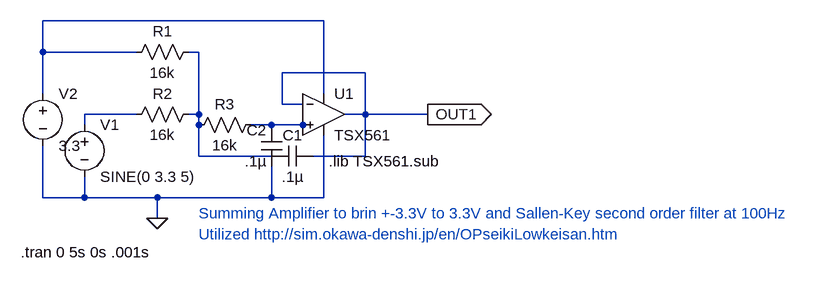
[diagram p0: schematic ECGADCBuffer.asc]
ECGADCBuffer.asc, the LTspice schematic file:
Version 4
SHEET 1 1268 680
WIRE 368 0 -64 0
WIRE -64 48 -64 0
WIRE 80 48 -64 48
WIRE 176 48 160 48
WIRE 432 80 304 80
WIRE -64 112 -64 48
WIRE 368 112 368 0
WIRE 304 128 304 80
WIRE 336 128 304 128
WIRE 80 144 0 144
WIRE 176 144 176 48
WIRE 176 144 160 144
WIRE 432 144 432 80
WIRE 432 144 400 144
WIRE 528 144 432 144
WIRE 0 160 0 144
WIRE 176 160 176 144
WIRE 288 160 256 160
WIRE 336 160 288 160
WIRE 352 160 336 160
WIRE 176 208 176 160
WIRE 288 208 176 208
WIRE 432 208 432 144
WIRE 432 208 352 208
WIRE -64 272 -64 192
WIRE 0 272 0 240
WIRE 0 272 -64 272
WIRE 112 272 0 272
WIRE 288 272 288 224
WIRE 288 272 112 272
WIRE 368 272 368 176
WIRE 368 272 288 272
WIRE 112 304 112 272
FLAG 112 304 0
FLAG 528 144 OUT1
IOPIN 528 144 Out
SYMBOL Opamps\\opamp2 368 80 R0
SYMATTR InstName U1
SYMATTR Value TSX561
SYMBOL res 176 32 R90
WINDOW 0 0 56 VBottom 2
WINDOW 3 32 56 VTop 2
SYMATTR InstName R1
SYMATTR Value 16k
SYMBOL res 176 128 R90
WINDOW 0 0 56 VBottom 2
WINDOW 3 32 56 VTop 2
SYMATTR InstName R2
SYMATTR Value 16k
SYMBOL cap 352 192 R90
WINDOW 0 0 32 VBottom 2
WINDOW 3 32 32 VTop 2
SYMATTR InstName C1
SYMATTR Value .1µ
SYMBOL voltage 0 144 R0
WINDOW 123 0 0 Left 2
WINDOW 39 0 0 Left 2
SYMATTR InstName V1
SYMATTR Value SINE(0 3.3 5)
SYMBOL voltage -64 96 R0
WINDOW 123 0 0 Left 2
WINDOW 39 0 0 Left 2
SYMATTR InstName V2
SYMATTR Value 3.3
SYMBOL res 272 144 R90
WINDOW 0 0 56 VBottom 2
WINDOW 3 32 56 VTop 2
SYMATTR InstName R3
SYMATTR Value 16k
SYMBOL cap 304 224 R180
WINDOW 0 24 56 Left 2
WINDOW 3 24 8 Left 2
SYMATTR InstName C2
SYMATTR Value .1µ
TEXT 376 216 Left 2 !.lib TSX561.sub
TEXT -98 356 Left 2 !.tran 0 5s 0s .001s
TEXT 176 296 Left 2 ;Summing Amplifier to brin +-3.3V to 3.3V and Sallen-Key second order filter at 100Hz
TEXT 176 328 Left 2 ;Utilized http://sim.okawa-denshi.jp/en/OPseikiLowkeisan.htm

The netlist it stands for:
* ECGADCBuffer.asc
XU1 N004 OUT1 N001 0 OUT1 TSX561  ; pins In+ In- V+ V- OUT
R1 N002 N001 16k
R2 N002 N003 16k
C1 OUT1 N002 .1µ
V1 N003 0 SINE(0 3.3 5)
V2 N001 0 3.3
R3 N004 N002 16k
C2 0 N004 .1µ
.lib TSX561.sub
.tran 0 5s 0s .001s
* Summing Amplifier to brin +-3.3V to 3.3V and Sallen-Key second order filter at 100Hz
* Utilized http://sim.okawa-denshi.jp/en/OPseikiLowkeisan.htm
.backanno
.end